# EasyEDA Pro project 鱼缸控制器(e-ink).epro, schematic Schematic2
Create Date: 2024-04-16; Page Name: P1; Project Name: 鱼缸控制器(e-ink); Schematic Name: Schematic2; Update Date: 2024-04-24; Company: 嘉立创EDA; Page Size: A2; Version: V1.0
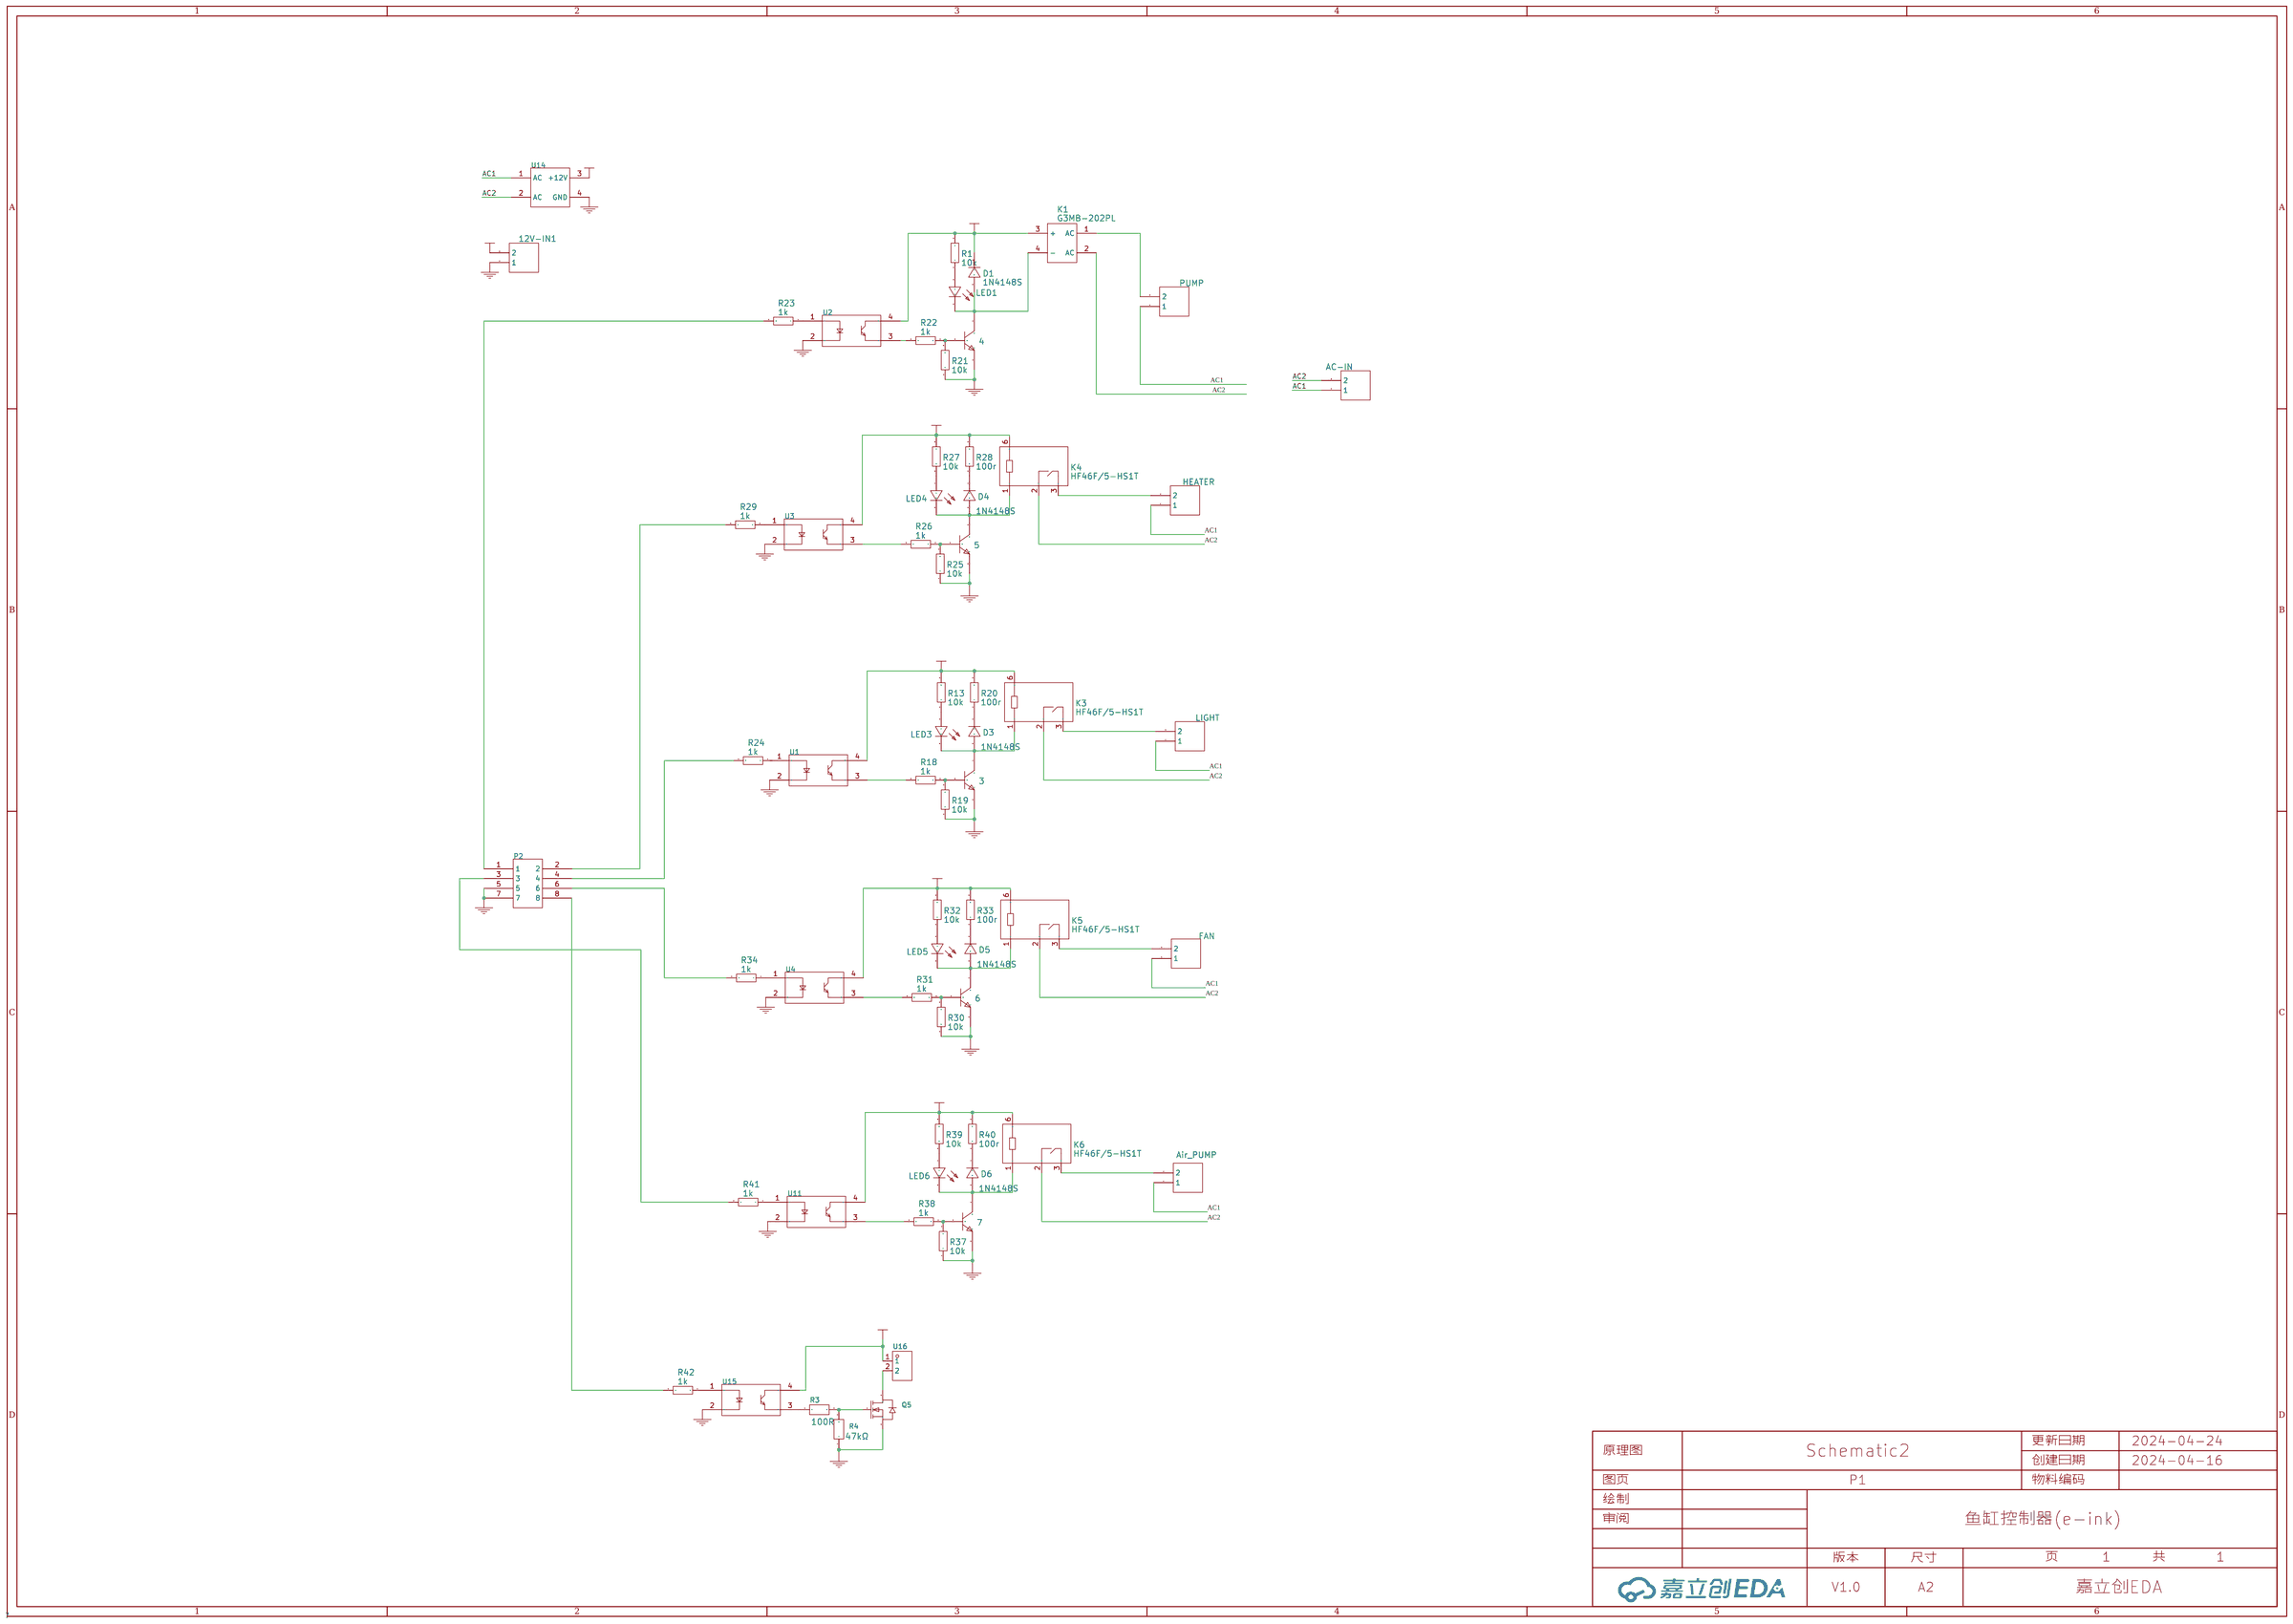
[diagram p0: schematic sheet]

## Parts
3  8050M-D  [TO-92-3_L4.8-W3.7-P2.54-R]
4  8050M-D  [TO-92-3_L4.8-W3.7-P2.54-R]
5  8050M-D  [TO-92-3_L4.8-W3.7-P2.54-R]
6  8050M-D  [TO-92-3_L4.8-W3.7-P2.54-R]
7  8050M-D  [TO-92-3_L4.8-W3.7-P2.54-R]
12V-IN1  SIP2  [CONN-TH_2P-P5.08_DB2EV-5.08-2P-BK]
AC-IN  SIP2  [CONN-TH_2P-P5.08_DB2EV-5.08-2P-BK]
Air_PUMP  SIP2  [CONN-TH_2P-P5.08_DB2EV-5.08-2P-BK]
D1  1N4148S  [DO-34_BD1.6-L3.0-P7.00-D0.6-RD]
D3  1N4148S  [DO-34_BD1.6-L3.0-P7.00-D0.6-RD]
D4  1N4148S  [DO-34_BD1.6-L3.0-P7.00-D0.6-RD]
D5  1N4148S  [DO-34_BD1.6-L3.0-P7.00-D0.6-RD]
D6  1N4148S  [DO-34_BD1.6-L3.0-P7.00-D0.6-RD]
FAN  SIP2  [CONN-TH_2P-P5.08_DB2EV-5.08-2P-BK]
HEATER  SIP2  [CONN-TH_2P-P5.08_DB2EV-5.08-2P-BK]
K1  G3MB-202PL  [RELAY-TH_G3MB-202PL]
K3  HF46F/5-HS1T  [RELAY-TH_HF46F/5-HS1T]
K4  HF46F/5-HS1T  [RELAY-TH_HF46F/5-HS1T]
K5  HF46F/5-HS1T  [RELAY-TH_HF46F/5-HS1T]
K6  HF46F/5-HS1T  [RELAY-TH_HF46F/5-HS1T]
LED1  19-213/R6C-AN2Q1B/3T  [LED-TH_BD3.2-P2.54-FD]
LED3  19-213/R6C-AN2Q1B/3T  [LED-TH_BD3.2-P2.54-FD]
LED4  19-213/R6C-AN2Q1B/3T  [LED-TH_BD3.2-P2.54-FD]
LED5  19-213/R6C-AN2Q1B/3T  [LED-TH_BD3.2-P2.54-FD]
LED6  19-213/R6C-AN2Q1B/3T  [LED-TH_BD3.2-P2.54-FD]
LIGHT  SIP2  [CONN-TH_2P-P5.08_DB2EV-5.08-2P-BK]
P2  DC3-8P  [DC3-8P]
PUMP  SIP2  [CONN-TH_2P-P5.08_DB2EV-5.08-2P-BK]
Q5  AOD4184A  [TO-252-2_L6.6-W6.1-P4.57-LS9.9-TL-CW]
R1  10k  [R_AXIAL-0.4]
R3  100R  [R_AXIAL-0.4]
R4  47kΩ  [R_AXIAL-0.4]
R13  10k  [R_AXIAL-0.4]
R18  1k  [R_AXIAL-0.4]
R19  10k  [R_AXIAL-0.4]
R20  100r  [R_AXIAL-0.4]
R21  10k  [R_AXIAL-0.4]
R22  1k  [R_AXIAL-0.4]
R23  1k  [R_AXIAL-0.4]
R24  1k  [R_AXIAL-0.4]
R25  10k  [R_AXIAL-0.4]
R26  1k  [R_AXIAL-0.4]
R27  10k  [R_AXIAL-0.4]
R28  100r  [R_AXIAL-0.4]
R29  1k  [R_AXIAL-0.4]
R30  10k  [R_AXIAL-0.4]
R31  1k  [R_AXIAL-0.4]
R32  10k  [R_AXIAL-0.4]
R33  100r  [R_AXIAL-0.4]
R34  1k  [R_AXIAL-0.4]
R37  10k  [R_AXIAL-0.4]
R38  1k  [R_AXIAL-0.4]
R39  10k  [R_AXIAL-0.4]
R40  100r  [R_AXIAL-0.4]
R41  1k  [R_AXIAL-0.4]
R42  1k  [R_AXIAL-0.4]
U1  PC817-4  [DIP-4_L4.6-W6.5-P2.54-LS7.6-BL]
U2  PC817-4  [DIP-4_L4.6-W6.5-P2.54-LS7.6-BL]
U3  PC817-4  [DIP-4_L4.6-W6.5-P2.54-LS7.6-BL]
U4  PC817-4  [DIP-4_L4.6-W6.5-P2.54-LS7.6-BL]
U11  PC817-4  [DIP-4_L4.6-W6.5-P2.54-LS7.6-BL]
U14  -  [瑞普达稳压模块]
U15  PC817-4  [DIP-4_L4.6-W6.5-P2.54-LS7.6-BL]
U16  WJ306V-5.0-2P-14-00A  [CONN-TH_2P-P5.00_L7.6-W10.0]

## Library data of the parts
3-7 = 8050M-D: Supplier: LCSC; Supplier Part: C305452; Manufacturer: BLUE ROCKET
12V-IN1 AC-IN Air_PUMP FAN HEATER LIGHT PUMP = SIP2: Manufacturer Part: ?
D1 D3-D6 = 1N4148S: Supplier: LCSC; Supplier Part: C179555; Manufacturer: Suzhou Good-Ark Elec
K1 = G3MB-202PL: Supplier: LCSC; Manufacturer: OMRON; Supplier Part: C48654
K3-K6 = HF46F/5-HS1T: Supplier: LCSC; Supplier Part: C182930; Manufacturer: Xiamen Hongfa Electroacoustic
LED1 LED3-LED6 = 19-213/R6C-AN2Q1B/3T: Supplier: LCSC; Supplier Part: C128251; Manufacturer: Everlight Elec
P2 = DC3-8P: _: 3
Q5 = AOD4184A: 类型:N沟道;漏源电压(Vdss):40V;连续漏极电流(Id):50A;功率(Pd):2.3W;导通电阻(RDS(on)@Vgs,Id):7mΩ@10V,20A;阈值电压(Vgs(th)@Id):2.6V@250A;; LCSC Part Name: N沟道 40V 50A; Supplier Part: C99124; Manufacturer: AOS; Supplier Footprint: TO-252-2(DPAK); JLCPCB Part Class: 扩展库; Datasheet: https://atta.szlcsc.com/upload/public/pdf/source/20170925/C99124_1506321783193990586.pdf; Supplier: LCSC; Type: N沟道; Drain Source Voltage (Vdss): 40V; Continuous Drain Current (Id): 50A; Power Dissipation (Pd): 2.3W; Drain Source On Resistance (RDS(on)@Vgs,Id): 7mΩ@10V,20A; Gate Threshold Voltage (Vgs(th)@Id): 2.6V@250A
R1 R13 R18 R20 R22-R24 R26-R29 R31-R34 R38-R42 = 1k: Manufacturer Part: ?
R3 R4 = ERA6VEB8201V: 电阻类型:薄膜电阻;阻值:8.2kΩ;精度:±0.1%;功率:250mW;温度系数:±25ppm/K;最大工作电压:150V;工作温度范围:-55℃~+155℃;; LCSC Part Name: 8.2kΩ ±0.1% 250mW; Supplier Part: C543719; Manufacturer: PANASONIC(松下); Supplier Footprint: 0805; JLCPCB Part Class: 扩展库; Datasheet: https://atta.szlcsc.com/upload/public/pdf/source/20200515/C543414_D3FB4A44C151AC19BA141503575FC797.pdf; Supplier: LCSC; Type: 薄膜电阻; Tolerance: ±0.1%; Power(Watts): 250mW; Temperature Coefficient: ±25ppm/K; Overload Voltage (Max): 150V; Operating Temperature Range: -55℃~+155℃
R19 R21 R25 R30 R37 = 10k: Manufacturer Part: ?
U1-U4 U11 U15 = PC817-4: Supplier Part: C33333; Supplier Footprint: DIP16; Supplier: LCSC
U14 = AC-DC-瑞普达
U16 = WJ306V-5.0-2P-14-00A: LCSC Part Name: 接线端子 直插式/5.0mm 4P 绿色; Supplier Part: C3031443; Manufacturer: KANGNEX(康奈克斯电气); Supplier Footprint: P=5.0mm; JLCPCB Part Class: 扩展库; Datasheet: https://atta.szlcsc.com/upload/public/pdf/source/20220629/C58904DE4C7373837BBB74E73B3FE59B.pdf; Supplier: LCSC

## Nets
+12V-P: 12V-IN1.2 D1.1 K1.3(+) K3.6 K4.6 K5.6 K6.6 R1.2 R13.2 R20.2 R27.2 R28.2 R32.2 R33.2 R39.2 R40.2 U1.4(COL) U2.4(COL) U3.4(COL) U4.4(COL) U11.4(COL) U14.3(+12V) U15.4(COL) U16.1
GND-P: 3.3(E) 4.3(E) 5.3(E) 6.3(E) 7.3(E) 12V-IN1.1 Q5.3(S) R4.1 R19.1 R21.1 R25.1 R30.1 R37.1 U14.4(GND)
GND-S: P2.5 P2.7 U1.2(C) U2.2(C) U3.2(C) U4.2(C) U11.2(C) U15.2(C)
AC1: AC-IN.1 Air_PUMP.1 FAN.1 HEATER.1 LIGHT.1 PUMP.1 U14.1(AC)
AC2: AC-IN.2 K1.2(AC) K3.2 K4.2 K5.2 K6.2 U14.2(AC)
$1N1574: 4.1(C) D1.2 K1.4(-) LED1.2(C)
$1N1576: 3.1(C) D3.2 K3.1 LED3.2(C)
$1N1577: R18.2 U1.3(EM)
$1N1579: K3.3 LIGHT.2
$1N1586: K1.1(AC) PUMP.2
$1N1589: LED1.1(A) R1.1
$1N1590: 3.2(B) R18.1 R19.2
$1N1591: LED3.1(A) R13.1
$1N1592: D3.1 R20.1
$1N1594: R22.2 U2.3(EM)
$1N1595: 4.2(B) R21.2 R22.1
$1N1598: R23.1 U2.1(A)
$1N1599: R24.1 U1.1(A)
$1N1602: 5.1(C) D4.2 K4.1 LED4.2(C)
$1N1603: R26.2 U3.3(EM)
$1N1605: HEATER.2 K4.3
$1N1610: 5.2(B) R25.2 R26.1
$1N1611: LED4.1(A) R27.1
$1N1612: D4.1 R28.1
$1N1613: R29.1 U3.1(A)
$1N1616: 6.1(C) D5.2 K5.1 LED5.2(C)
$1N1617: R31.2 U4.3(EM)
$1N1619: FAN.2 K5.3
$1N1624: 6.2(B) R30.2 R31.1
$1N1625: LED5.1(A) R32.1
$1N1626: D5.1 R33.1
$1N1627: R34.1 U4.1(A)
$1N1630: 7.1(C) D6.2 K6.1 LED6.2(C)
$1N1631: R38.2 U11.3(EM)
$1N1633: Air_PUMP.2 K6.3
$1N1638: 7.2(B) R37.2 R38.1
$1N1639: LED6.1(A) R39.1
$1N1640: D6.1 R40.1
$1N1641: R41.1 U11.1(A)
$1N1644: P2.6 R34.2
$1N1645: P2.4 R24.2
$1N1646: P2.2 R29.2
$1N1647: P2.1 R23.2
$1N5127: P2.3 R41.2
$1N5160: P2.8 R42.2
$1N5227: R42.1 U15.1(A)
$1N5390: Q5.1(G) R3.2 R4.2
$1N5392: Q5.2(D) U16.2
$1N5396: R3.1 U15.3(EM)
